# Altium schematic sheet Fuente.SchDoc
size A4; SheetNumber: 2; SheetTotal: 8
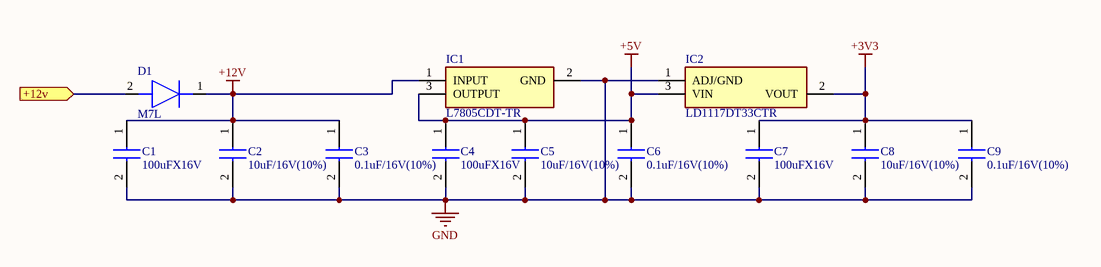
[diagram p0: Fuente.SchDoc]

## Parts
C1  100uFX16V  [CAPAE660X550N]
C2  10uF/16V(10%)  [CAPC3216X100N]
C3  0.1uF/16V(10%)  [CAPC3216X100N]
C4  100uFX16V  [CAPAE660X550N]
C5  10uF/16V(10%)  [CAPC3216X100N]
C6  0.1uF/16V(10%)  [CAPC3216X100N]
C7  100uFX16V  [CAPAE660X550N]
C8  10uF/16V(10%)  [CAPC3216X100N]
C9  0.1uF/16V(10%)  [CAPC3216X100N]
D1  M7L  [DIONM5327X240N]
IC1  L7805CDT-TR  [L7805CDTTR]
IC2  LD1117DT33CTR  [L7805CDTTR]

## Ports
+12v (in)

## Nets
+3V3: C7.1(+) C8.1 C9.1 IC2.2(VOUT)
+5V: C4.1(+) C5.1 C6.1 IC1.3(OUTPUT) IC2.3(VIN)
+12V: C1.1(+) C2.1 C3.1 D1.1(K) IC1.1(INPUT)
GND: C1.2(-) C2.2 C3.2 C4.2(-) C5.2 C6.2 C7.2(-) C8.2 C9.2 IC1.2(GND) IC2.1(ADJ/GND)
+12v: D1.2(A) ; port +12v  [a separate net that carries the same name]

## Library data of the parts
C1 C4 C7 = NACE101M16V6.3X5.5TR13F: 100UFX16V 20%. 6.3x5.4 ELE.RAD.SMD; Manufacturer_Name: NIC Components; Datasheet Link: http://uk.rs-online.com/web/p/products/7379631; Height: 5.5mm; Manufacturer_Part_Number: NACE101M16V6.3X5.5TR13F; Arrow Part Number: NACE101M16V6.3X5.5TR13F; Arrow Price/Stock: https://www.arrow.com/en/products/nace101m16v6.3x5.5tr13f/nic-components
C2 C3 C5 C6 C8 C9 = CL31B104KBCNNNC: 100NFX50V X7R 10% CER.MULT. SMD 1206; Manufacturer_Name: Samsung Electro-Mechanics; Datasheet Link: https://datasheet.datasheetarchive.com/originals/distributors/Datasheets_SAMA/0fdb6a11e020a7299f4d0713dd2bd7ee.pdf; Height: 1mm; Manufacturer_Part_Number: CL31B104KBCNNNC; Mouser Part Number: 187-CL31B104KBCNNNC; Mouser Price/Stock: https://www.mouser.co.uk/ProductDetail/Samsung-Electro-Mechanics/CL31B104KBCNNNC?qs=349EhDEZ59oHABbyGq1iKA%3D%3D; Arrow Part Number: CL31B104KBCNNNC; Arrow Price/Stock: https://www.arrow.com/en/products/cl31b104kbcnnnc/samsung-electro-mechanics?region=nac
D1 = M7L: Diode; Manufacturer_Name: Diotec; Datasheet Link: https://www.mouser.in/ProductDetail/Diotec-Semiconductor/M7L?qs=Wj%2FVkw3K%252BMDMylK9y%2FQg4g%3D%3D; Height: 2.4mm; Manufacturer_Part_Number: M7L; Mouser Part Number: 637-M7L; Mouser Price/Stock: https://www.mouser.co.uk/ProductDetail/Diotec-Semiconductor/M7L?qs=Wj%2FVkw3K%252BMDMylK9y%2FQg4g%3D%3D
IC1 = L7805CDT-TR: Integrated Circuit; Manufacturer_Name: STMicroelectronics; Datasheet Link: https://componentsearchengine.com/Datasheets/2/L7805CDT-TR.pdf; Height: 2.63mm; Manufacturer_Part_Number: L7805CDT-TR; Mouser Part Number: 511-L7805CDT-TR; Mouser Price/Stock: https://www.mouser.co.uk/ProductDetail/STMicroelectronics/L7805CDT-TR?qs=gq%2F78KzUDX67VndS%2FbSB4Q%3D%3D; Arrow Part Number: L7805CDT-TR; Arrow Price/Stock: https://www.arrow.com/en/products/l7805cdt-tr/stmicroelectronics?region=europe
IC2 = LD1117DT33CTR: TO-252-3/DPACK 0.95A 3.3V; Manufacturer_Name: STMicroelectronics; Datasheet Link: https://www.st.com/resource/en/datasheet/ld1117.pdf; Height: 2.48mm; Manufacturer_Part_Number: LD1117DT33CTR; Mouser Part Number: 511-LD1117DT33C-TR; Mouser Price/Stock: https://www.mouser.co.uk/ProductDetail/STMicroelectronics/LD1117DT33CTR?qs=rUxiu3TV3%2FNm%2FOyb7vJzpg%3D%3D; Arrow Part Number: LD1117DT33CTR; Arrow Price/Stock: https://www.arrow.com/en/products/ld1117dt33ctr/stmicroelectronics?region=nac